# EasyEDA Pro project MicronetToNMEA.eprj

# Schematic Schematics

## Sheets
1 RF: Board Name: MicronetToNMEA; Create Date: 2024-10-03; Page Name: RF; Project Name: MicronetToNMEA; Schematic Name: MicronetToNMEA; Update Date: 2025-01-01; Company: EasyEDA.com; Drawn: EasyEDA; Page Size: A4; Part Number: JLCPCB-002; Reviewed: EasyEDA; Version: V0.1
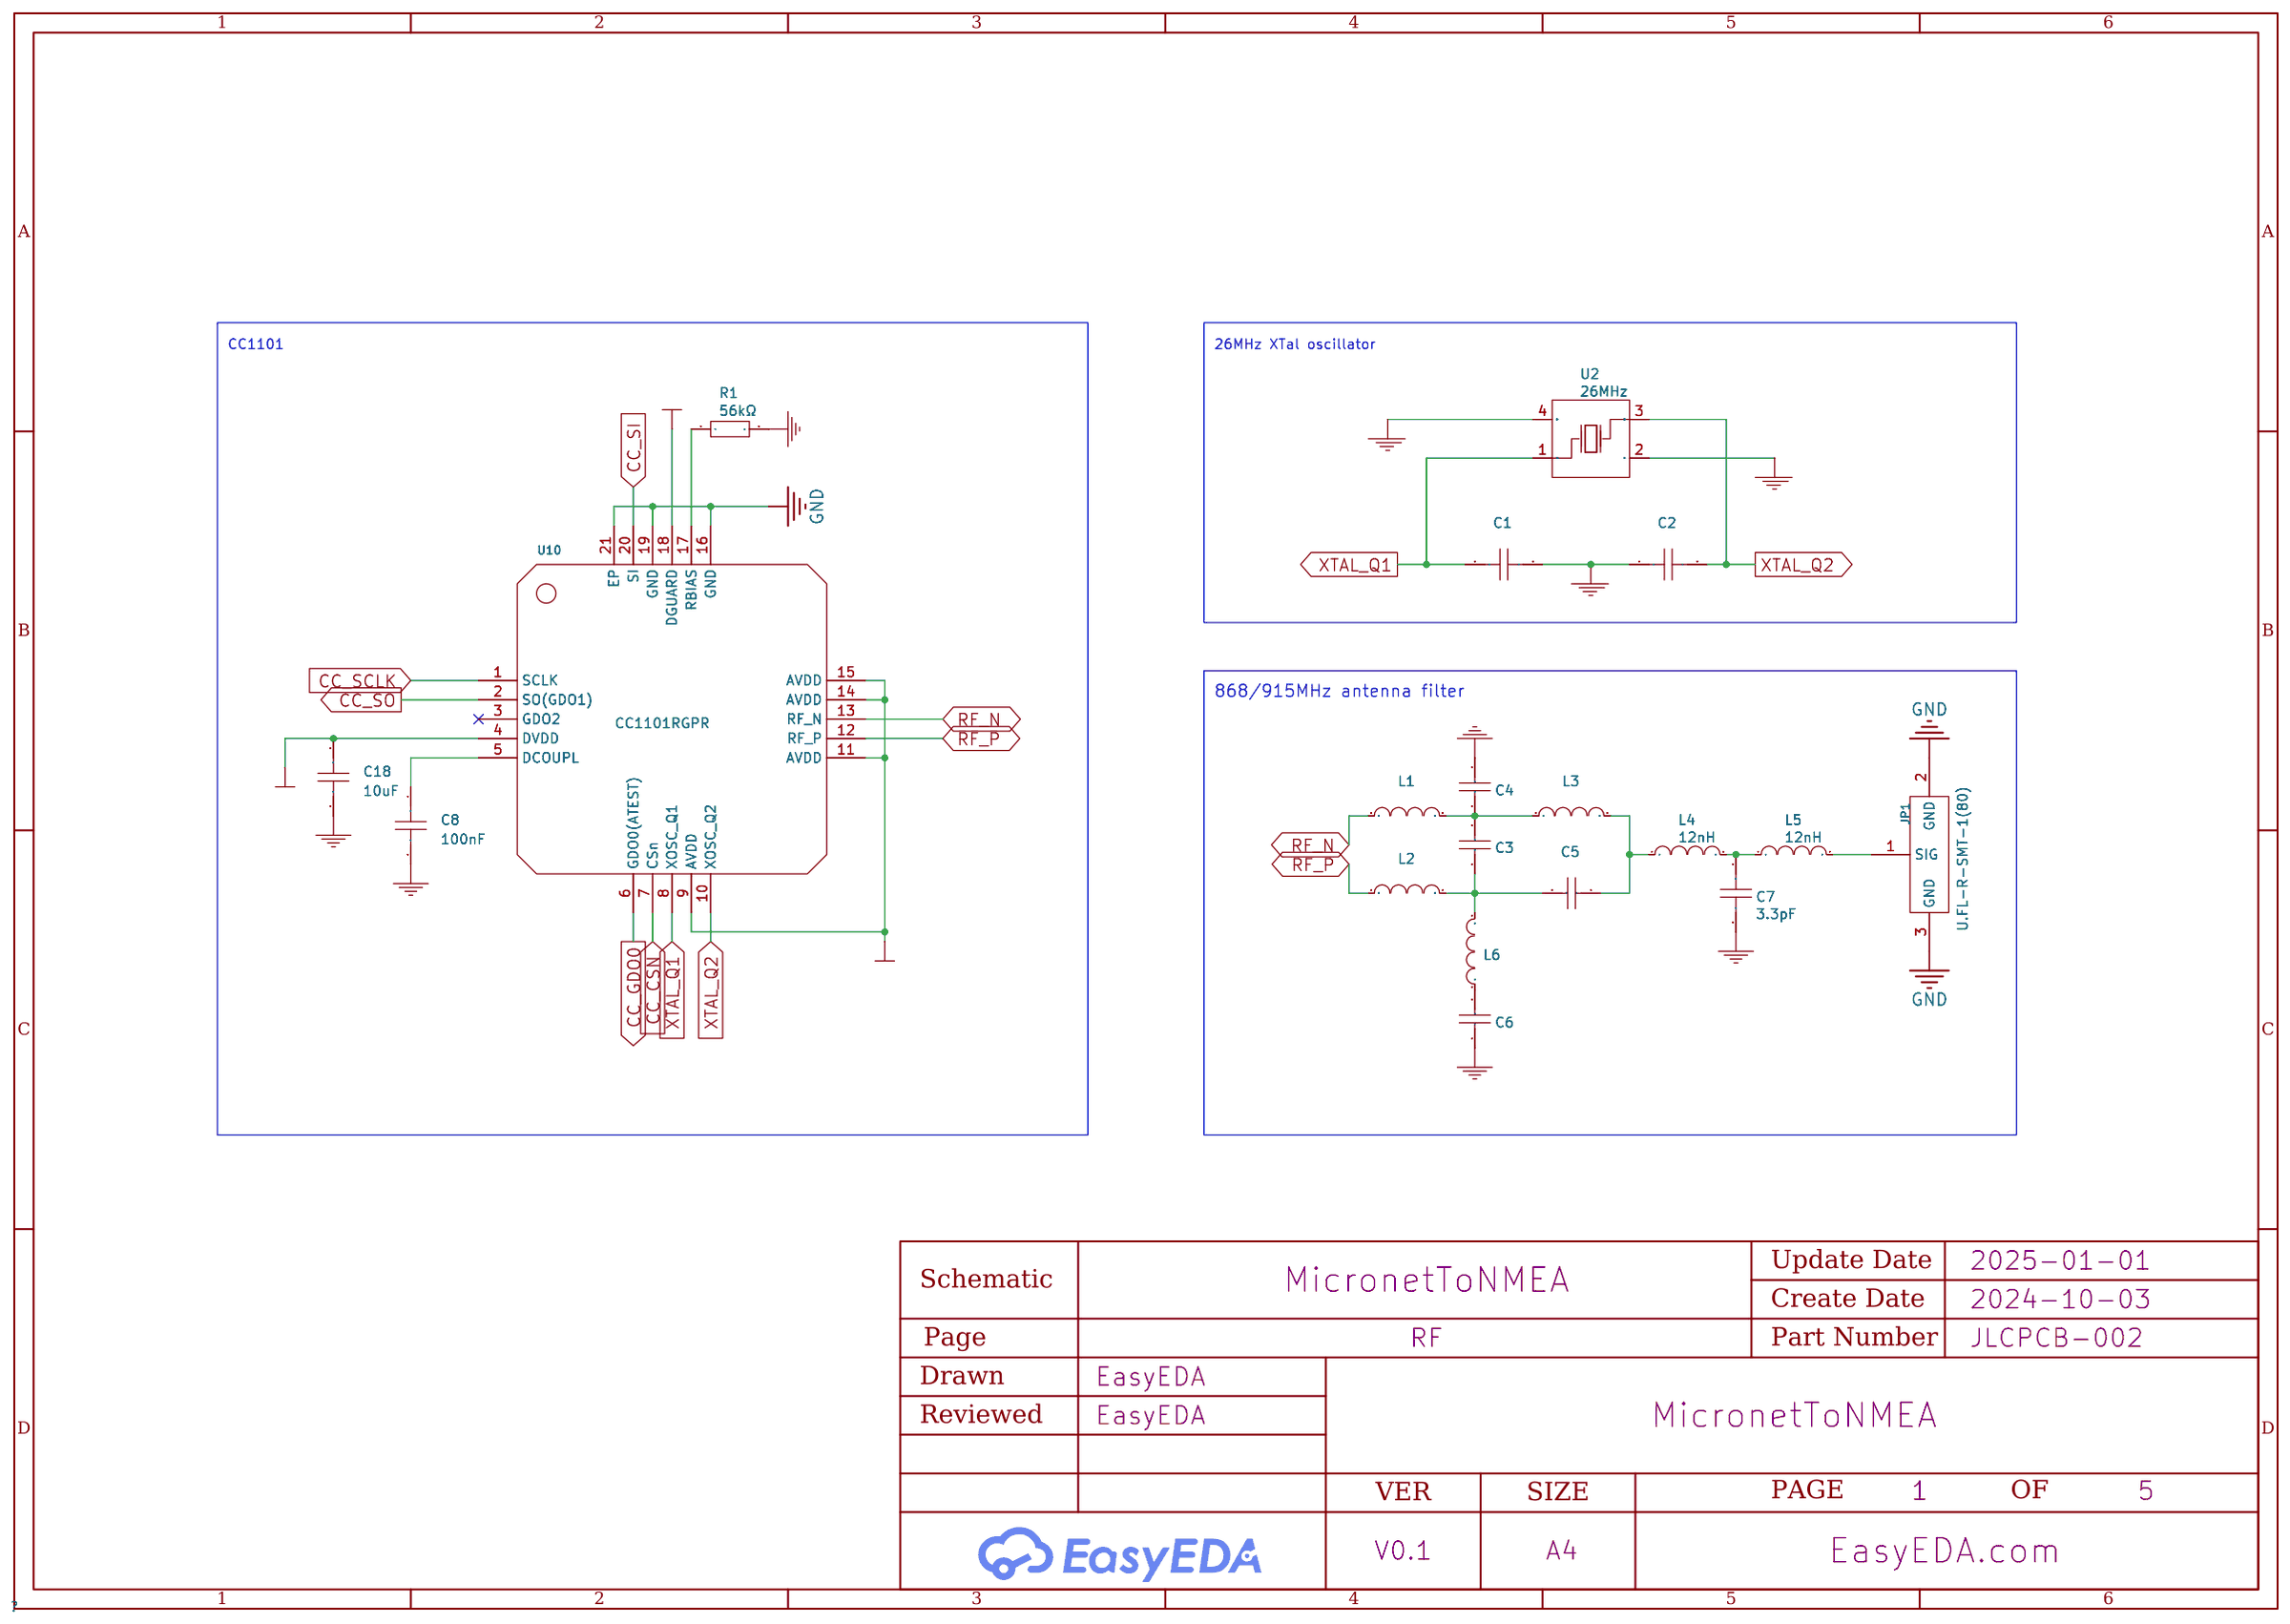
[diagram p0: RF]
2 MCU: Page Name: MCU; Schematic Name: Schematics; Update Date: 2025-01-11
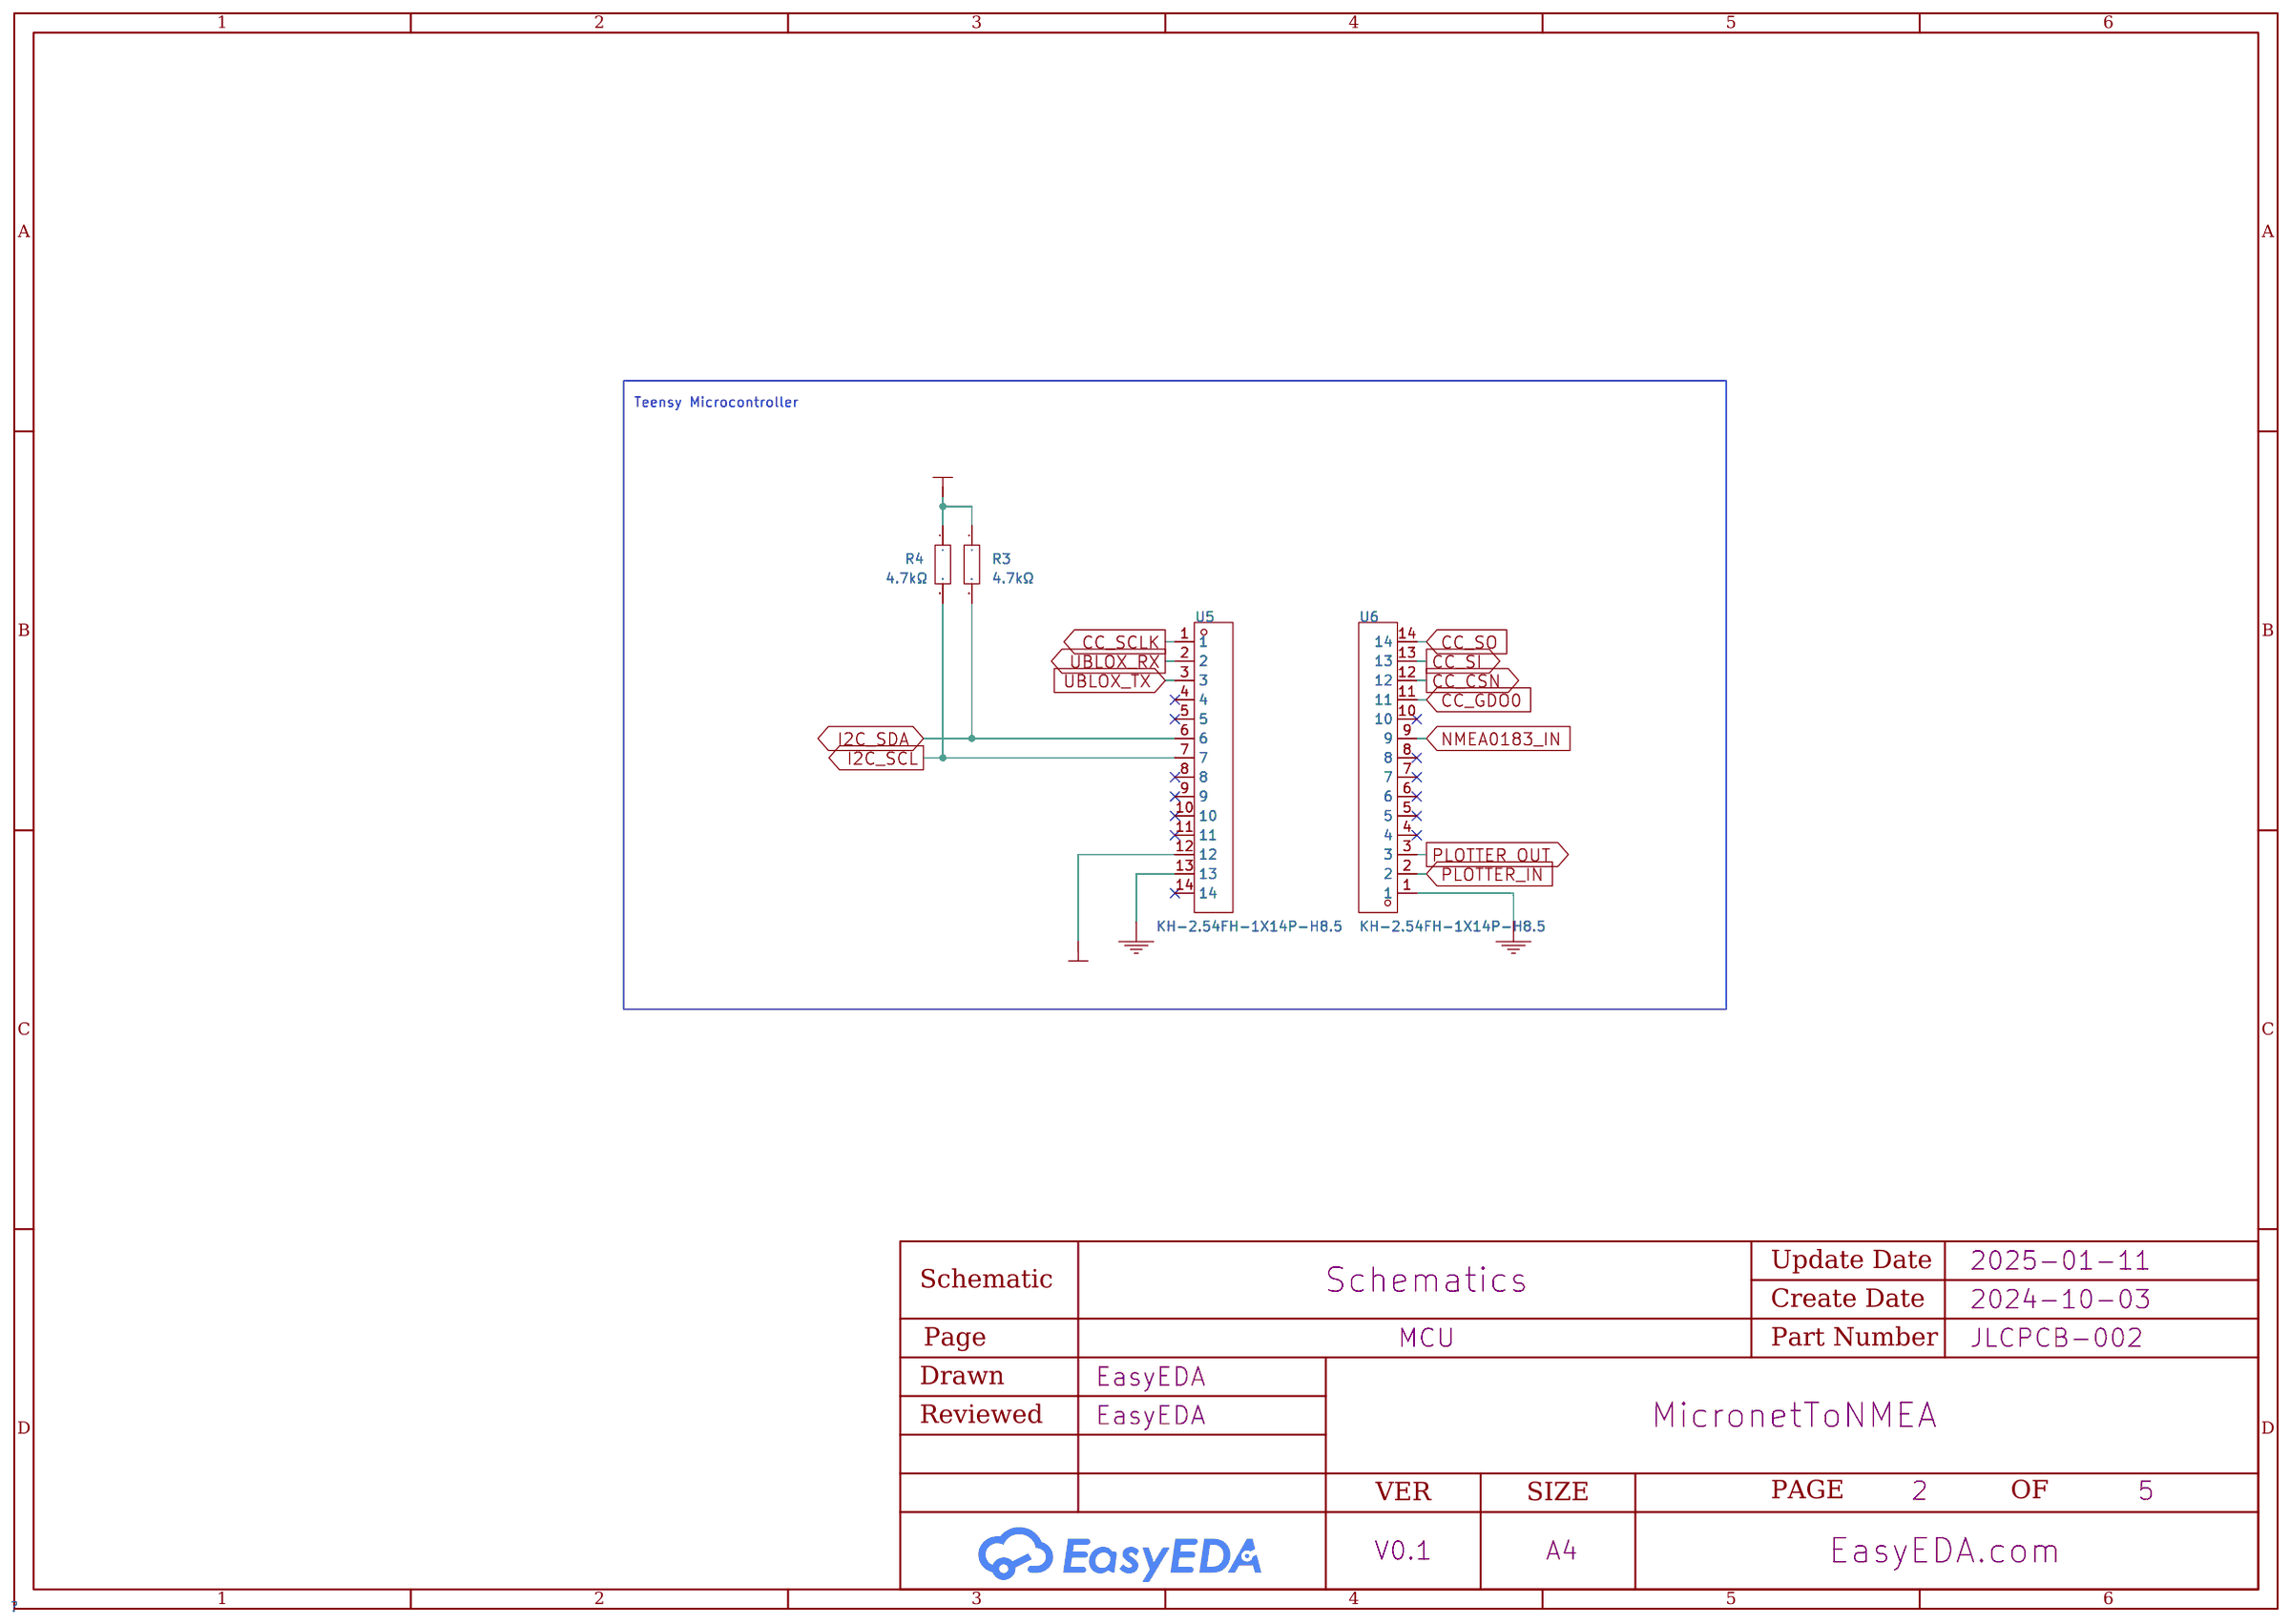
[diagram p1: MCU]
3 Peripherals: Create Date: 2024-10-08; Page Name: Peripherals; Schematic Name: Schematics; Update Date: 2025-01-06
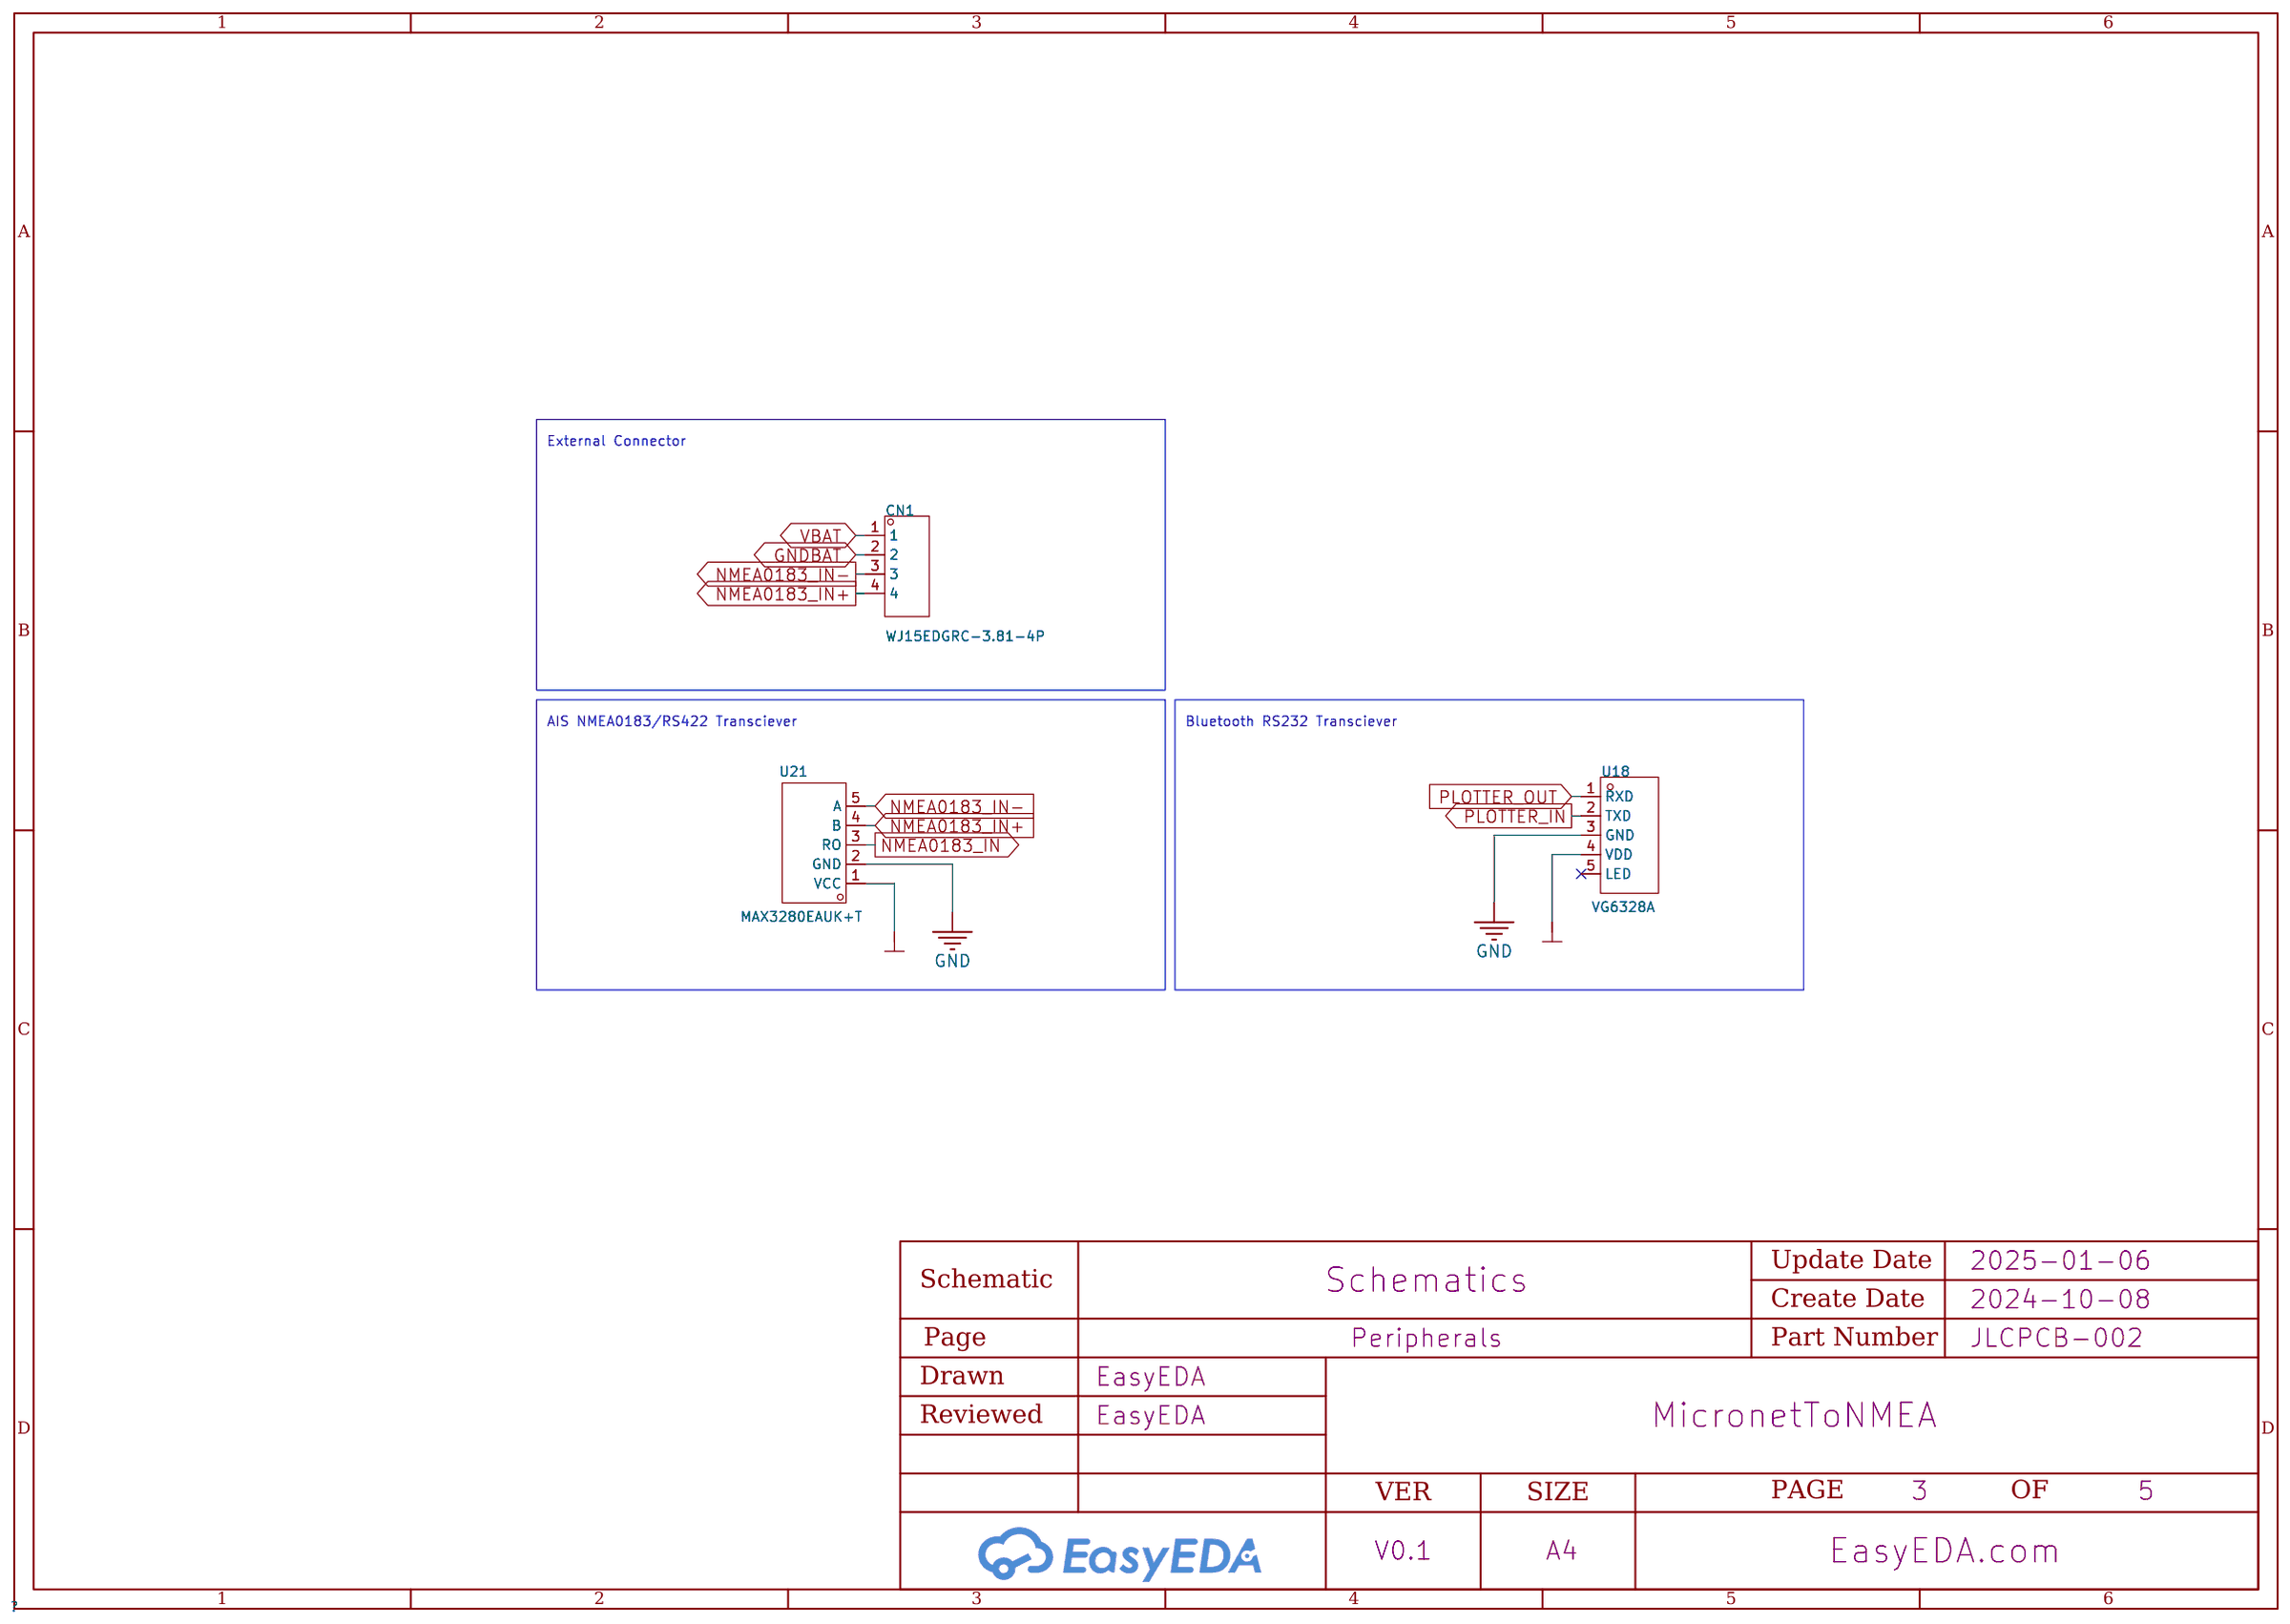
[diagram p2: Peripherals]
4 Sensors: Create Date: 2024-11-14; Page Name: Sensors; Schematic Name: Schematics; Update Date: 2025-01-29
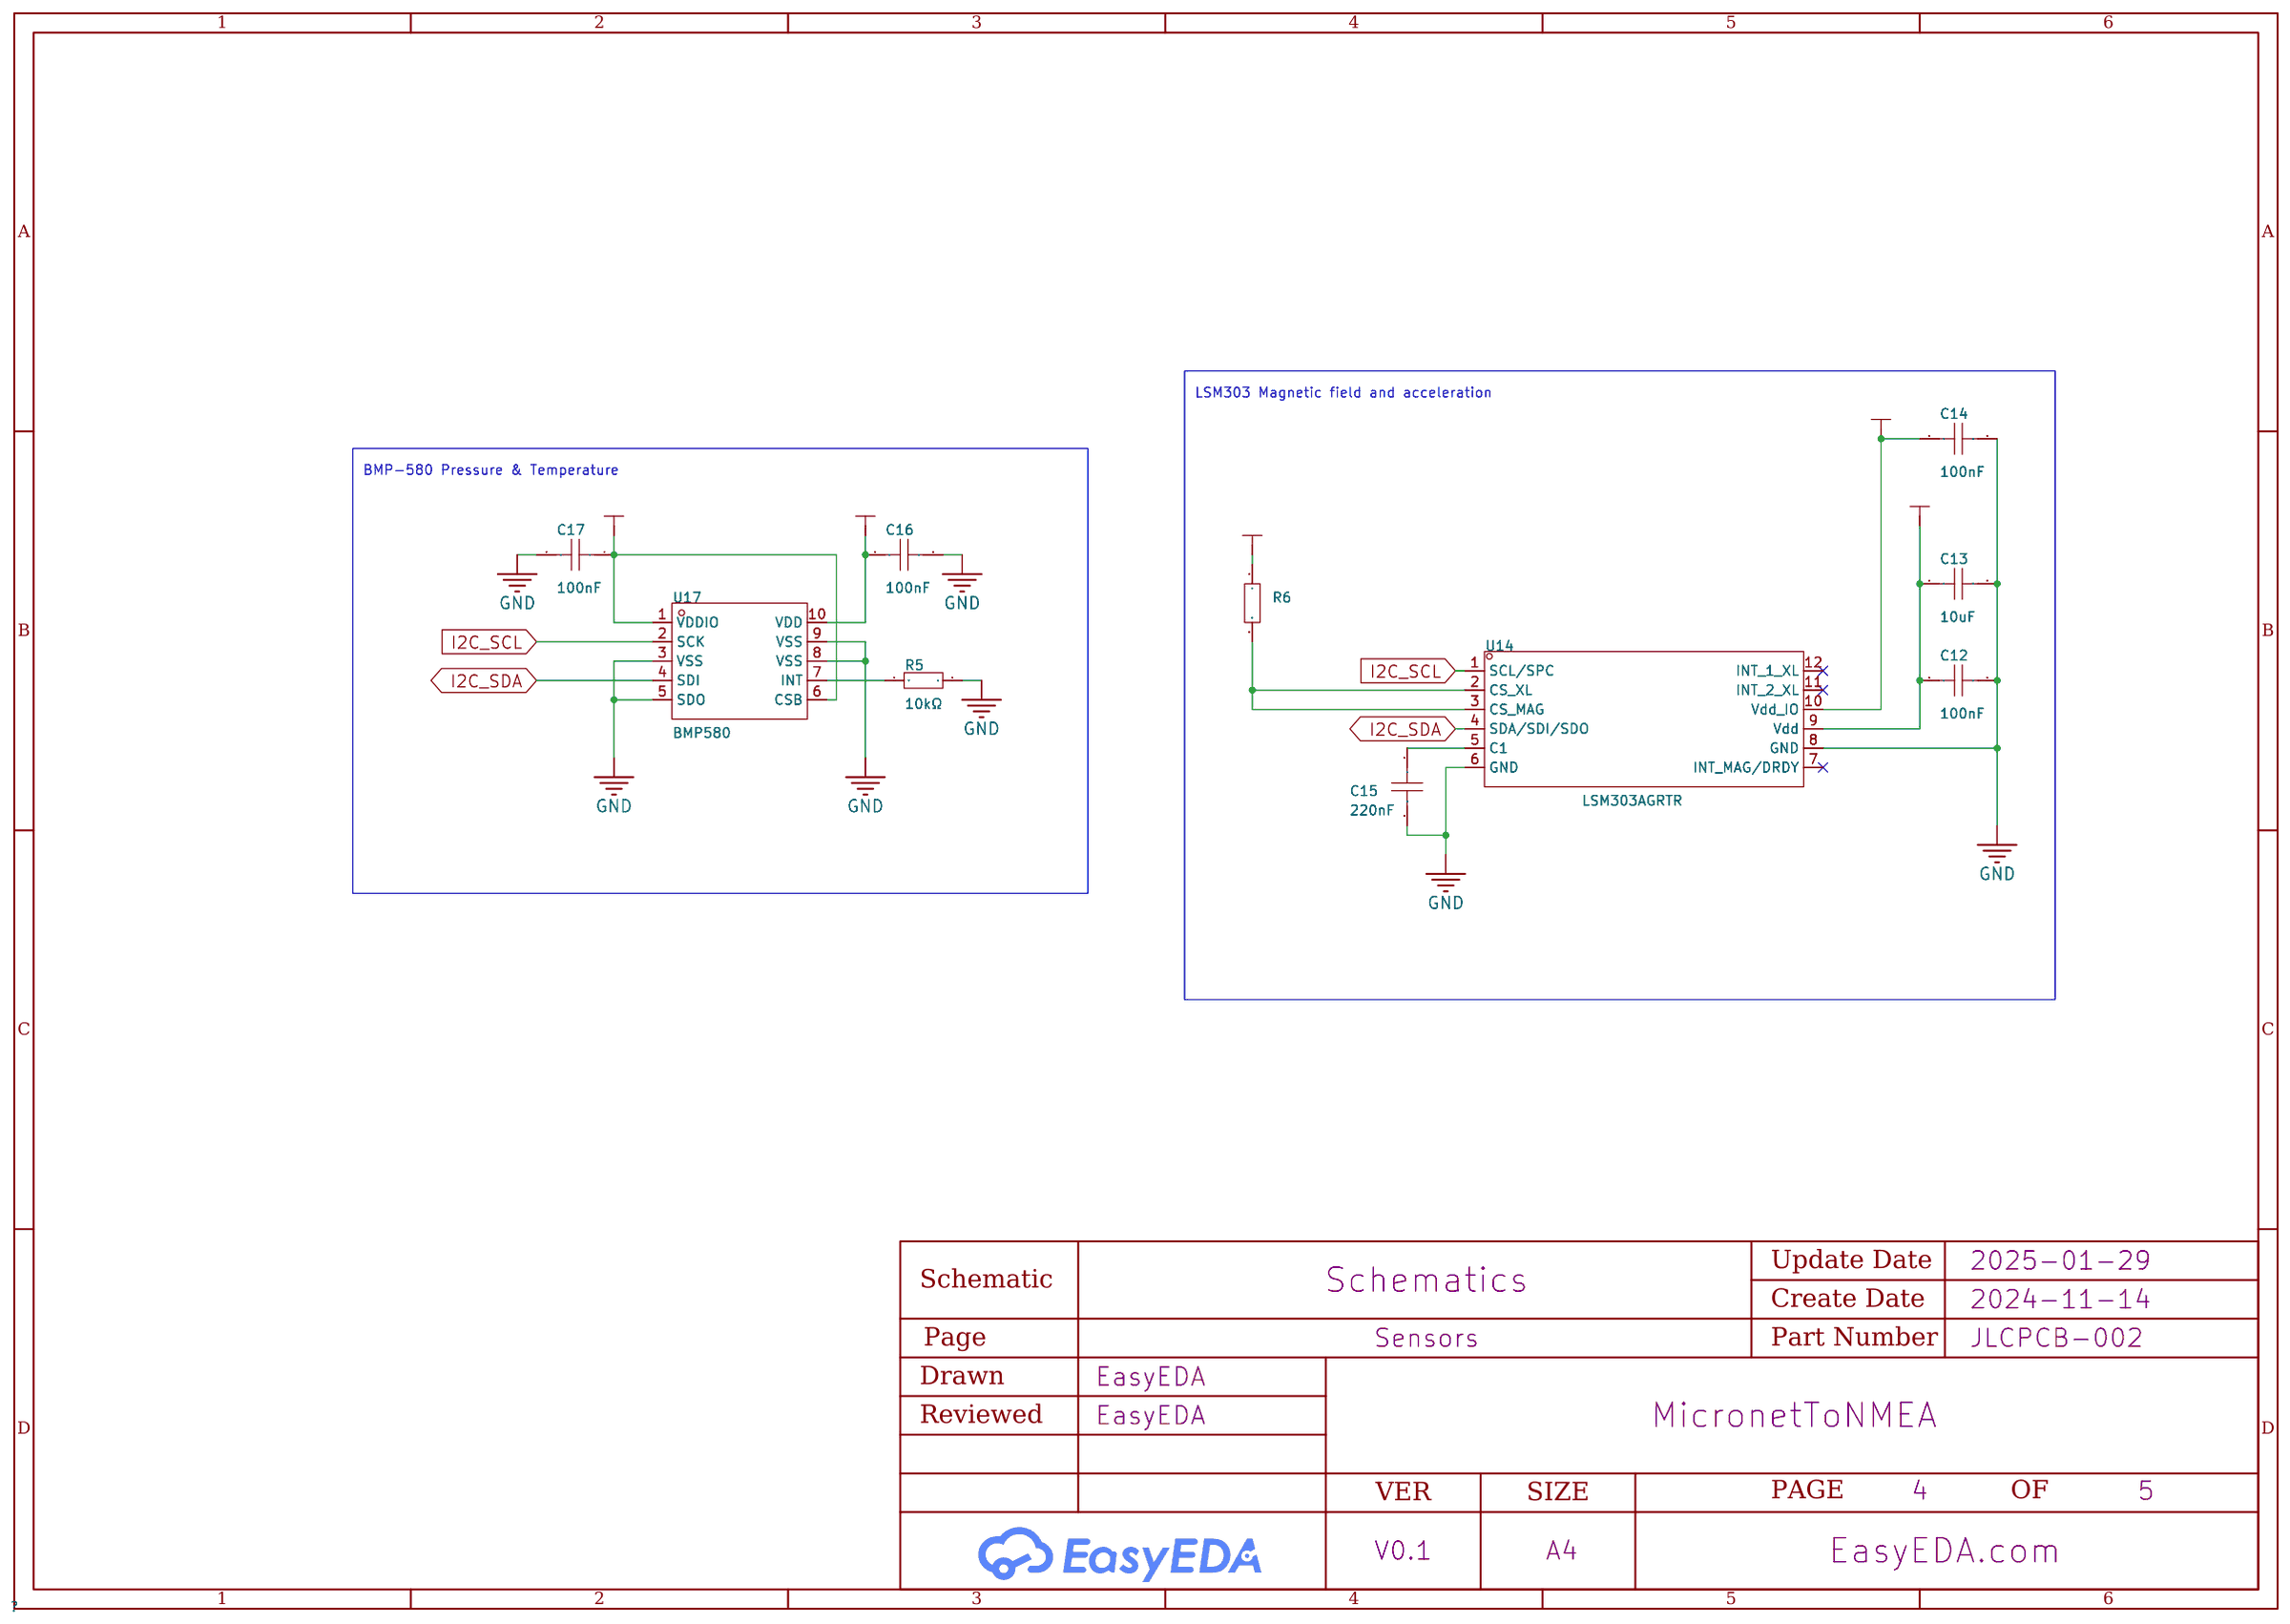
[diagram p3: Sensors]
5 Power: Create Date: 2024-11-25; Page Name: Power; Schematic Name: Schematics; Update Date: 2025-01-18
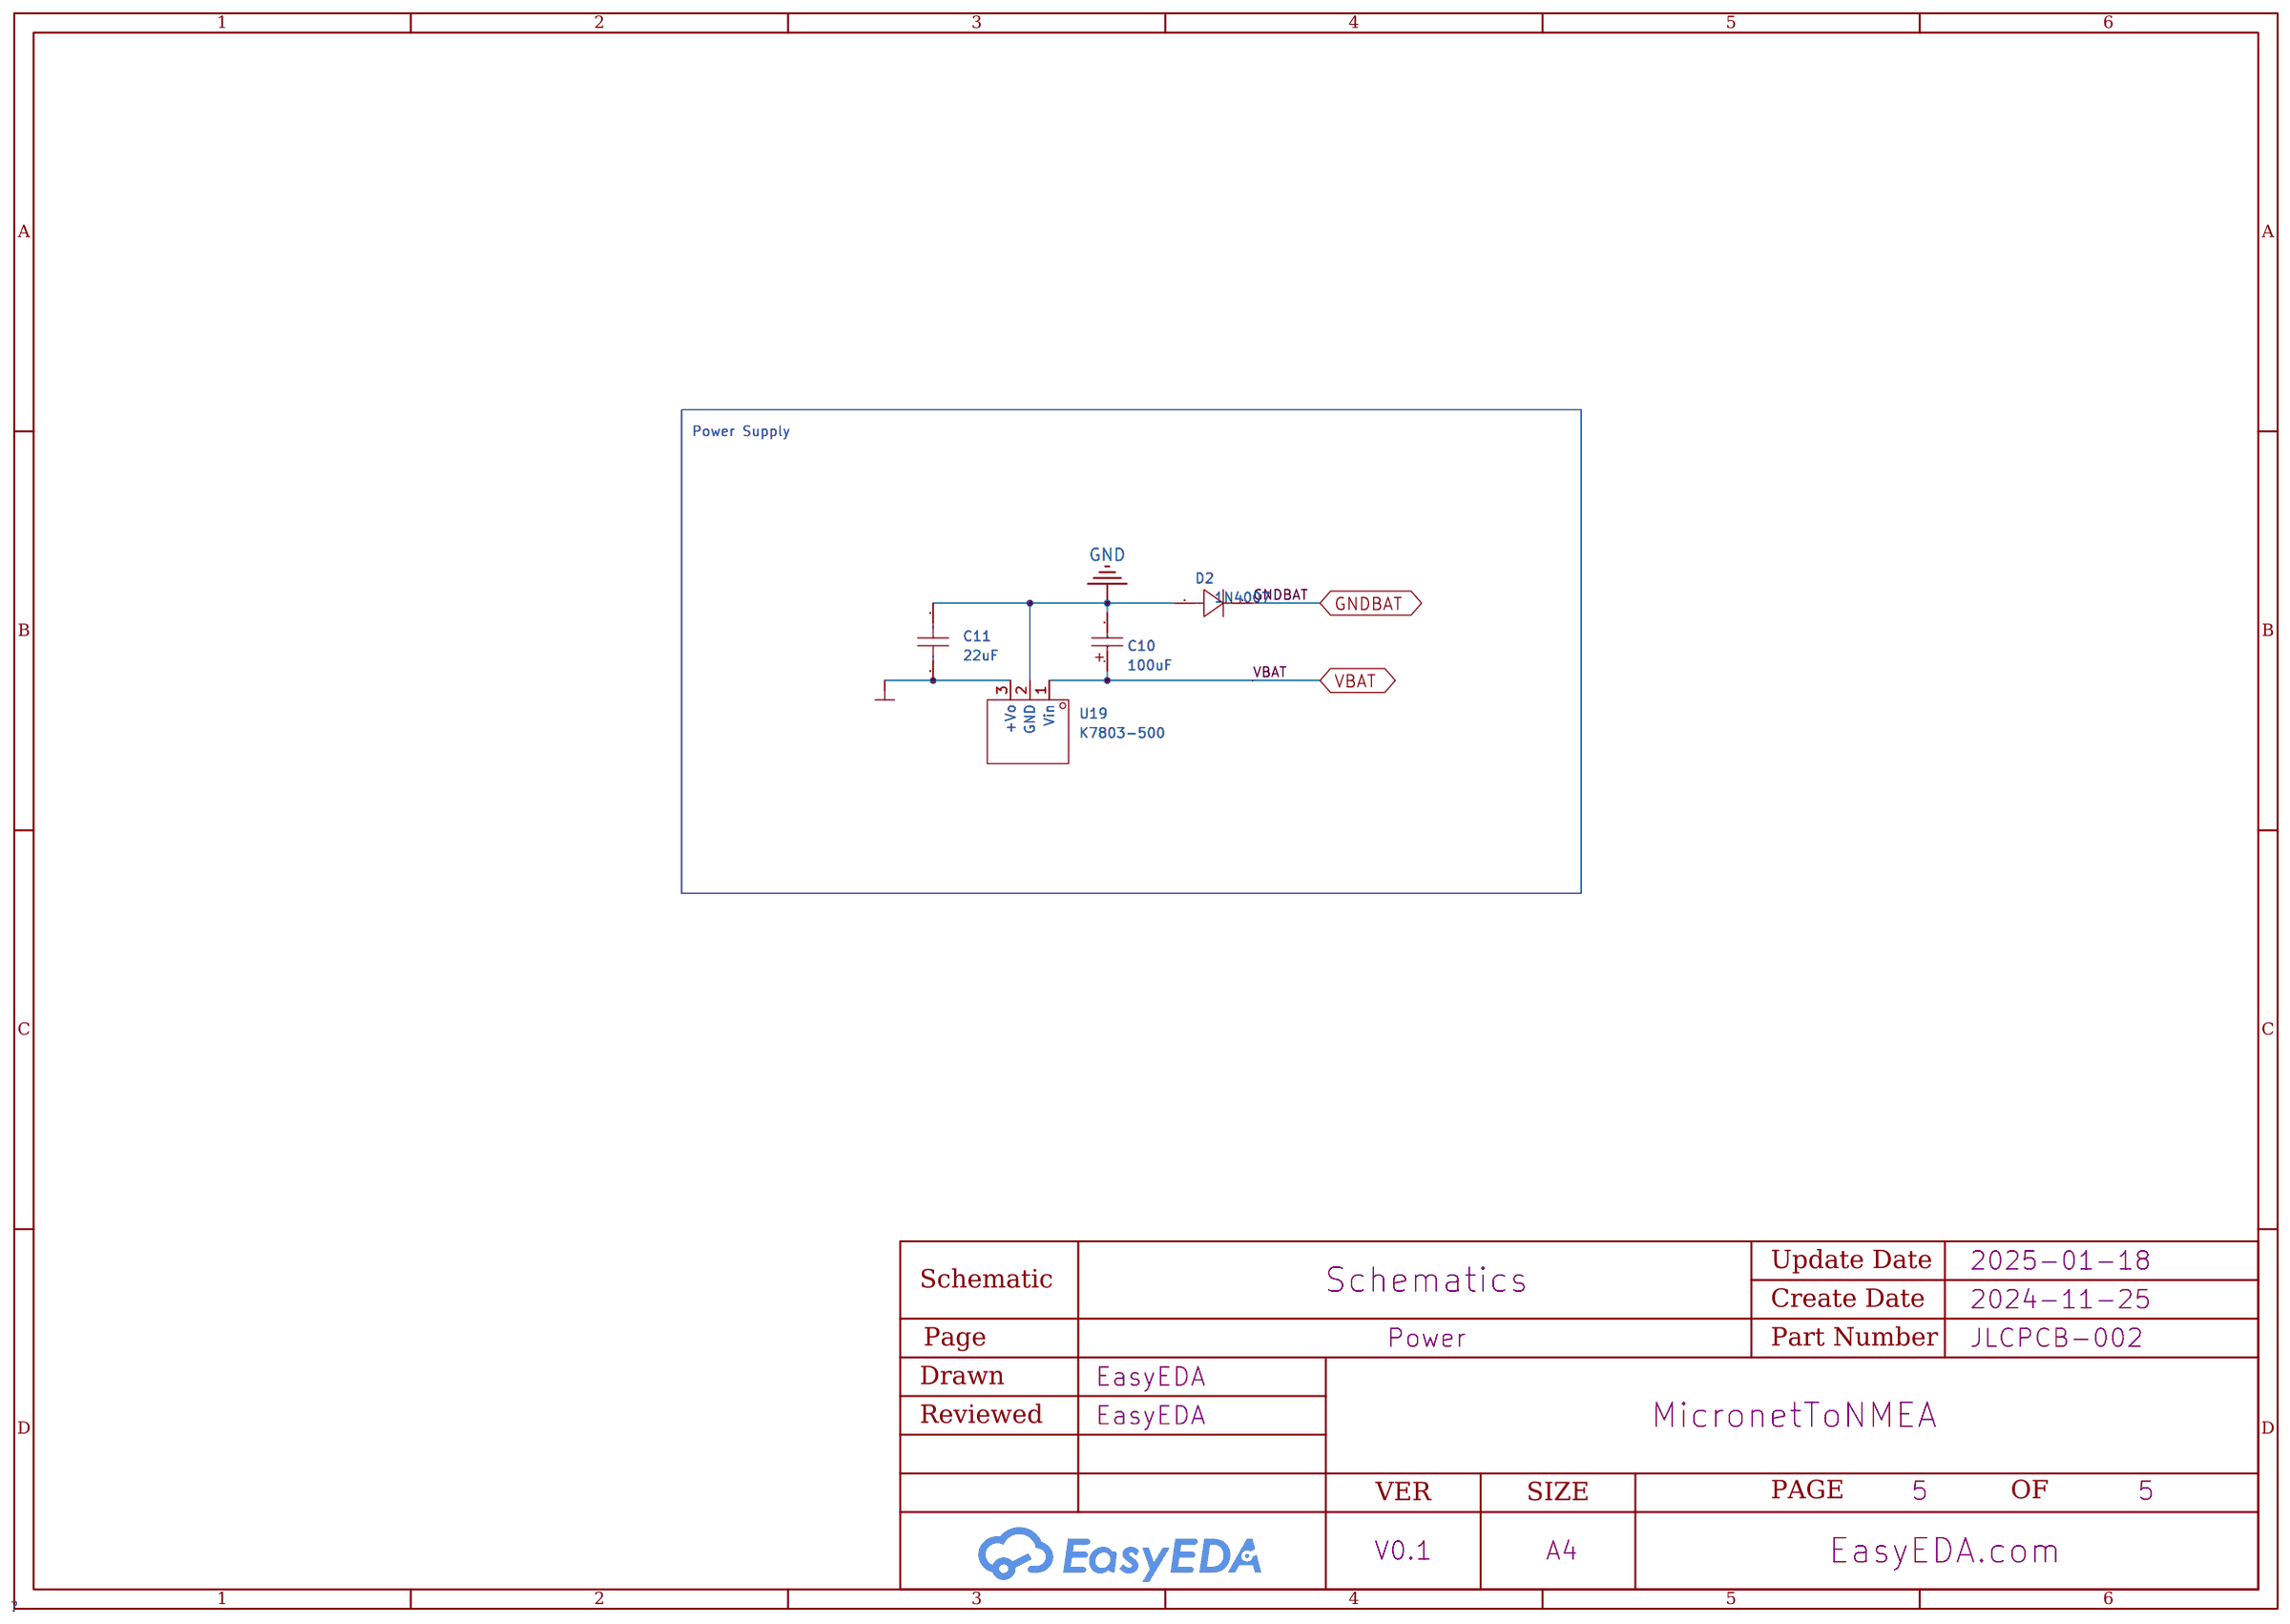
[diagram p4: Power]

## Parts
sheet MCU
R3  4.7kΩ  [R0402]
R4  4.7kΩ  [R0402]
U5  KH-2.54FH-1X14P-H8.5  [HDR-TH_14P-P2.54-V-F]
U6  KH-2.54FH-1X14P-H8.5  [HDR-TH_14P-P2.54-V-F]
sheet Peripherals
CN1  WJ15EDGRC-3.81-4P  [CONN-TH_WJ15EDGRC-3.81-4P]
U18  VG6328A  [COMM-SMD_VG6328A]
U21  MAX3280EAUK+T  [SOT-23-5_L3.0-W1.7-P0.95-LS2.8-BL]
sheet Power
C10  100uF  [CAP-SMD_BD8.0-L8.3-W8.3-FD]
C11  22uF  [C0603]
D2  1N4007  [SMA_L4.3-W2.5-LS5.0-RD]
U19  K7803-500  [PWRM-TH_K7803-500]
sheet RF
C1  27pF  [C0402]
C2  27pF  [C0402]
C3  1pF  [C0402]
C4  1.5pF  [C0402]
C5  1.5pF  [C0402]
C6  100pF  [C0402]
C7  3.3pF  [C0402]
C8  100nF  [C0402]
C18  10uF  [C0402]
JP1  U.FL-R-SMT-1(80)  [RF-SMD_FRF05002-JSS103M]
L1  12nH  [L0402]
L2  12nH  [L0402]
L3  18nH  [L0402]
L4  12nH  [L0402]
L5  12nH  [L0402]
L6  18nH  [L0402]
R1  56kΩ  [R0402]
U2  26MHz  [CRYSTAL-SMD_4P-L3.2-W2.5-BL]
U10  CC1101RGPR  [QFN-20_L4.0-W4.0-P0.5-TL-EP]
sheet Sensors
C12  100nF  [C0402]
C13  10uF  [C0402]
C14  100nF  [C0402]
C15  220nF  [C0402]
C16  100nF  [C0402]
C17  100nF  [C0402]
R5  10kΩ  [R0402]
R6  10kΩ  [R0402]
U14  LSM303AGRTR  [LGA-12_L2.0-W2.0-P0.50-BL]
U17  BMP580  [LGA-10_L2.0-W2.0-P0.50-TL_BMP580]

## Library data of the parts
R3 R4 = 0402WGF4701TCE: Type:Thick Film Resistors Resistance:4.7kΩ Tolerance:±1% Tolerance:±1% Power(Watts): Overload Voltage (Max): Temperature Coefficient:±100ppm/℃ Temperature Coefficient:±100ppm/℃ Operating Temperature Range:-55℃~+155℃ Operating Temperature Range:-55℃~+155℃; LCSC Part Name: 4.7kΩ ±1% 62.5mW 厚膜电阻; Supplier Part: C25900; Manufacturer: UNI-ROYAL(厚声); Supplier Footprint: 0402; JLCPCB Part Class: Basic Part; Datasheet: https://atta.szlcsc.com/upload/public/pdf/source/20200306/C422600_1E6D84923E4A46A82E41ADD87F860B5C.pdf; Supplier: LCSC; Type: Thick Film Resistors; Tolerance: ±1%; Temperature Coefficient: ±100ppm/℃; Operating Temperature Range: -55℃~+155℃; Check: true
U5 U6 = KH-2.54FH-1X14P-H8.5: LCSC Part Name: 间距:2.54mm 1x14P 直插; Supplier Part: C2905420; Manufacturer: kinghelm(金航标); Supplier Footprint: 插件,P=2.54mm; JLCPCB Part Class: Extended Part; Datasheet: https://atta.szlcsc.com/upload/public/pdf/source/20211019/C0FA6756E08ED2BF7CCB872A948D877C.pdf; Supplier: LCSC; Holes Structure: 1x14P; Pitch: 2.54mm; Circular Hole / Square Hole: Square Holes; Mounting Type: Straight; Number of Rows: Plugin; Number of Holes: 14P; Current Rating (Max): 3A; Holes Direction: Top; Insulation Height: 8.5mm; Operating Temperature Range: -40℃~+105℃
CN1 = WJ15EDGRC-3.81-4P: Connector Type:Receptacle-Close fixed form:- Structure:1x4P Pitch:3.81mm Color:- Mounting Style:Bend Number of Pins:4P Number of Rows:1 Number of PINs Per Row:4 Current Rating (Max):8A Voltage Rating (Max):300V Wire Gauge - AWG:- Wire Gauge - AWG:- Wire G; LCSC Part Name: 1x4P 3.81mm 排数:1 每排P数:4; Supplier Part: C7245; Manufacturer: KANGNEX(康奈克斯电气); Supplier Footprint: 弯插,P=3.81mm; JLCPCB Part Class: Extended Part; Datasheet: https://atta.szlcsc.com/upload/public/pdf/source/20191225/C7245_837ECEBE031BAC19A7EBD4F3127022E5.pdf; Supplier: LCSC; Connector Type: Receptacle-Close; Structure: 1x4P; Pitch: 3.81mm; Mounting Style: Bend; Number of Pins: 4P; Number of Rows: 1; Number of PINs Per Row: 4; Current Rating (Max): 8A; Voltage Rating (Max): 300V; Contact Material: Brass; Contact Plating: Tin; Operating Temperature Range: -40℃~+105℃
U18 = VG6328A: LCSC Part Name: 6328A低成本串口蓝牙模块; Supplier Part: C20539408; Manufacturer: Vollgo(沃进); Supplier Footprint: SMD,16x13.6mm; JLCPCB Part Class: Extended Part; Datasheet: https://atta.szlcsc.com/upload/public/pdf/source/20240112/5EEE1D6A89302B67E38E5FC88F83A793.pdf; Supplier: LCSC; Check: true
U21 = MAX3280EAUK+T: Types:Receivers Number of Driver:0 Number of receiver:1 Supply Voltage:3V~5.5V Supply Voltage:3V~5.5V Data Rate:52Mbps Data Rate:52Mbps Operating Temperature:-40℃~+125℃ Operating Temperature:-40℃~+125℃; LCSC Part Name: ±15kV ESD保护，52Mbps，3V至5.5V，SOT23封装RS-485/RS-422真故障安全接收器; Supplier Part: C131126; Manufacturer: ADI(亚德诺)/MAXIM(美信); Supplier Footprint: SOT-23-5; JLCPCB Part Class: Extended Part; Datasheet: https://atta.szlcsc.com/upload/public/pdf/source/20170919/C131126_1505787254709976995.pdf; Supplier: LCSC; Types: Receivers; Number of Driver: 0; Number of receiver: 1; Supply Voltage: 3V~5.5V; Data Rate: 52Mbps; Operating Temperature: -40℃~+125℃; Check: true
C10 = EEEFK1H101P_C178548: Capacitance: Tolerance:±20% Tolerance:±20% Rated Voltage: Ripple Current:262.5mA@120Hz Equivalent Series Resistance(ESR):- φD: L: Lifetime @ Temp:5000hrs@105℃ Operating Temperature:-55℃~+105℃ Operating Temperature:-55℃~+105℃; LCSC Part Name: 100uF ±20% 50V; Supplier Part: C178548; Manufacturer: PANASONIC(松下); Manufacturer Part: EEEFK1H101P; Supplier Footprint: SMD,D8xL10.2mm; JLCPCB Part Class: Extended Part; Datasheet: https://atta.szlcsc.com/upload/public/pdf/source/20180327/C178734_B73BC829014A39870A1CD50DCE59BFEE.pdf; Supplier: LCSC; Tolerance: ±20%; Ripple Current: 262.5mA@120Hz; Lifetime @ Temp: 5000hrs@105℃; Operating Temperature: -55℃~+105℃
C11 = CL10A226MO7JZNC: Capacitance: Tolerance:±20% Tolerance:±20% Voltage Rated: Temperature Coefficient:; LCSC Part Name: 22uF ±20% 16V; Supplier Part: C2762594; Manufacturer: SAMSUNG(三星); Supplier Footprint: 0603; JLCPCB Part Class: Extended Part; Datasheet: https://atta.szlcsc.com/upload/public/pdf/source/20220811/0832C3B1C642040B023B7A6186895861.pdf; Supplier: LCSC; Tolerance: ±20%
D2 = 1N4007_C727081: Diode Configuration:Independent Type Forward Voltage (Vf@If):1.1V@1A Reverse Voltage (Vr): Rectified Current: Reverse Leakage Current (Ir):5uA; Supplier Part: C727081; Manufacturer: TWGMC(台湾迪嘉); Supplier Footprint: SMA(DO-214AC); JLCPCB Part Class: Extended Part; Datasheet: https://atta.szlcsc.com/upload/public/pdf/source/20200828/C727079_3A05254382567072883400655AE0ED46.pdf; Supplier: LCSC; Diode Configuration: Independent Type; Forward Voltage (Vf@If): 1.1V@1A; Reverse Leakage Current (Ir): 5uA
U19 = K7803-500_C19191249: Supplier Part: C19191249; Manufacturer: DEXU(德旭电子); Supplier Footprint: SIP-3; JLCPCB Part Class: Extended Part; Datasheet: https://atta.szlcsc.com/upload/public/pdf/source/20231110/2DF27CB59CC75D0EC81D3527E3B2B1C5.pdf; Supplier: LCSC
C1 C2 = GJM1555C1H270FB01D: Capacitance: Tolerance:±1% Tolerance:±1% Voltage Rated: Temperature Coefficient:; LCSC Part Name: 27pF ±1% 50V; Supplier Part: C88883; Manufacturer: muRata(村田); Supplier Footprint: 0402; JLCPCB Part Class: Extended Part; Datasheet: https://atta.szlcsc.com/upload/public/pdf/source/20190904/C426118_85E81C7C1F21FC87C5FB6D536E0847B4.pdf; Supplier: LCSC; Tolerance: ±1%; Check: true
C3 = GRM1555C1H1R0CA01D: Capacitance: Voltage Rated: Temperature Coefficient:; LCSC Part Name: 1pF 50V; Supplier Part: C76953; Manufacturer: muRata(村田); Supplier Footprint: 0402; JLCPCB Part Class: Extended Part; Datasheet: https://atta.szlcsc.com/upload/public/pdf/source/20180307/C76953_15204091218821407741.pdf; Supplier: LCSC; Check: true
C4 C5 = GRM1555C1H1R5BA01D: Capacitance: Voltage Rated: Temperature Coefficient:; LCSC Part Name: 1.5pF 50V; Supplier Part: C76957; Manufacturer: muRata(村田); Supplier Footprint: 0402; JLCPCB Part Class: Extended Part; Datasheet: https://atta.szlcsc.com/upload/public/pdf/source/20180307/C76957_15204091256371407745.pdf; Supplier: LCSC; Check: true
C6 = GRM1555C1H101JA01D: Capacitance: Tolerance:±5% Tolerance:±5% Voltage Rated: Temperature Coefficient:; LCSC Part Name: 100pF ±5% 50V; Supplier Part: C77177; Manufacturer: muRata(村田); Supplier Footprint: 0402; JLCPCB Part Class: Extended Part; Datasheet: https://atta.szlcsc.com/upload/public/pdf/source/20161108/1478586482814.pdf; Supplier: LCSC; Tolerance: ±5%; Check: true
C7 = GRM1555C1H3R3CA01D: Capacitance: Voltage Rated: Temperature Coefficient:; LCSC Part Name: 3.3pF 50V; Supplier Part: C76968; Manufacturer: muRata(村田); Supplier Footprint: 0402; JLCPCB Part Class: Extended Part; Datasheet: https://atta.szlcsc.com/upload/public/pdf/source/20180326/C76968_42A943F46D0EB2822F2395CFA6966D50.pdf; Supplier: LCSC; Check: true
C8 = GRM155R62A104KE14D: Capacitance: Tolerance:±10% Tolerance:±10% Voltage Rated: Temperature Coefficient:; LCSC Part Name: 100nF ±10% 100V; Supplier Part: C162178; Manufacturer: muRata(村田); Supplier Footprint: 0402; JLCPCB Part Class: Extended Part; Datasheet: https://atta.szlcsc.com/upload/public/pdf/source/20200921/C162178_EF61A2DC43497DE67E2F462D3389BE9B.pdf; Supplier: LCSC; Tolerance: ±10%; Check: true
C18 = GRM155R61A106ME44D: Capacitance: Tolerance:±20% Tolerance:±20% Voltage Rated: Temperature Coefficient:; LCSC Part Name: 10uF ±20% 10V; Supplier Part: C77000; Manufacturer: muRata(村田); Supplier Footprint: 0402; JLCPCB Part Class: Extended Part; Datasheet: https://atta.szlcsc.com/upload/public/pdf/source/20180530/C77000_4866797CFE3A842CD03C597EBD6AE6CD.pdf; Supplier: LCSC; Tolerance: ±20%
JP1 = U.FL-R-SMT-1(80)_C88374: LCSC Part Name: IPEX 内针; Supplier Part: C88374; Manufacturer: HRS(广濑); Supplier Footprint: SMD; JLCPCB Part Class: Extended Part; Datasheet: https://atta.szlcsc.com/upload/public/pdf/source/20161125/1480067868647.pdf; Supplier: LCSC; Connector Type: 板端; Interface Type: 内针; Number of Ports: 1; Interface Diameter: 2mm; Interface Length/Height: 1.25mm; Frequency-Max: 6GHz; RF Series: IPEX; Impedance: 50Ω; Contact Material: Brass; Operating Temperature Range: -40℃~+90℃; Check: true
L1 L2 = LQW15AN12NJ00D: Inductance: Tolerance:±5% Tolerance:±5% Rated Current: Saturation Current (Isat):- DC Resistance (DCR): Ratings:-; LCSC Part Name: 12nH ±5%; Supplier Part: C82920; Manufacturer: muRata(村田); Supplier Footprint: 0402; JLCPCB Part Class: Extended Part; Datasheet: https://atta.szlcsc.com/upload/public/pdf/source/20170505/1493951387766.pdf; Supplier: LCSC; Tolerance: ±5%; Check: true
L3 L6 = LQW15AN18NJ00D: Inductance: Tolerance:±5% Tolerance:±5% Rated Current: Saturation Current (Isat):- DC Resistance (DCR): Ratings:-; LCSC Part Name: 18nH ±5%; Supplier Part: C82917; Manufacturer: muRata(村田); Supplier Footprint: 0402; JLCPCB Part Class: Extended Part; Datasheet: https://atta.szlcsc.com/upload/public/pdf/source/20170325/1490427880337.pdf; Supplier: LCSC; Tolerance: ±5%; Check: true
L4 L5 = LQW15AN12NG00D: Inductance: Tolerance:±2% Tolerance:±2% Rated Current: Saturation Current (Isat):- DC Resistance (DCR): Ratings:-; LCSC Part Name: 12nH ±2%; Supplier Part: C86128; Manufacturer: muRata(村田); Supplier Footprint: 0402; JLCPCB Part Class: Extended Part; Datasheet: https://atta.szlcsc.com/upload/public/pdf/source/20161104/1478253457680.pdf; Supplier: LCSC; Tolerance: ±2%; Check: true
R1 = RK73H1ETTP5602F: Type:Thick Film Resistors Resistance: Tolerance:±1% Tolerance:±1% Power(Watts): Overload Voltage (Max): Temperature Coefficient:±100ppm/℃ Temperature Coefficient:±100ppm/℃ Operating Temperature Range:-55℃~+155℃ Operating Temperature Range:-55℃~+155℃; LCSC Part Name: 厚膜电阻 56kΩ ±1% 100mW; Supplier Part: C71703; Manufacturer: KOA; Supplier Footprint: 0402; JLCPCB Part Class: Extended Part; Datasheet: https://atta.szlcsc.com/upload/public/pdf/source/20180126/C171778_15169517982501308609.pdf; Supplier: LCSC; Type: Thick Film Resistors; Tolerance: ±1%; Temperature Coefficient: ±100ppm/℃; Operating Temperature Range: -55℃~+155℃; Check: true
U2 = S3226000151040: Crystal Type:贴片晶振 Frequency: Normal temperature Frequency Tolerance:±10ppm Normal temperature Frequency Tolerance:±10ppm External load capacitor: Equivalent Series Resistance (ESR):40Ω Operating Temperature: Operating Temperature:; LCSC Part Name: 26MHz ±10ppm 15pF; Supplier Part: C479205; Manufacturer: JGHC(晶光华); Supplier Footprint: SMD3225-4P; JLCPCB Part Class: Extended Part; Datasheet: https://atta.szlcsc.com/upload/public/pdf/source/20230522/40D5BBD3CE23FDD9A2980F79514F1325.pdf; Supplier: LCSC; Crystal Type: 贴片晶振; Normal temperature Frequency Tolerance: ±10ppm; Equivalent Series Resistance (ESR): 40Ω; Check: true
U10 = CC1101RGPR: LCSC Part Name: 低功率射频收发器 专为极低功耗无线应用设计; Supplier Part: C29953; Manufacturer: TI(德州仪器); Supplier Footprint: QFN-20-EP(4x4); JLCPCB Part Class: Extended Part; Datasheet: https://www.ti.com/cn/lit/gpn/cc1101; Supplier: LCSC; Frequency Range: 779MHz~928MHz；300MHz~348MHz; Interface: SPI; Operating Voltage: 1.8V~3.6V; Applications: General-purposeISM; Output Power: 12dBm; Data Rate: 600Kbps; Current Of Transmitting: 12.3mA; Sensitivity: -116dBm; Receive Current: 14.3mA; Typical Application Frequency: 433MHz；315MHz; Operating Temperature: -40℃~+85℃; Check: true
C12 C14 C16 C17 = CL05B104KO5NNNC: Capacitance: Tolerance:±10% Tolerance:±10% Voltage Rated: Temperature Coefficient:; LCSC Part Name: 100nF ±10% 16V; Supplier Part: C1525; Manufacturer: SAMSUNG(三星); Supplier Footprint: 0402; JLCPCB Part Class: Basic Part; Datasheet: https://atta.szlcsc.com/upload/public/pdf/source/20160218/1457707763339.pdf; Supplier: LCSC; Tolerance: ±10%
C13 = GRM155R60J106ME44D: Capacitance: Tolerance:±20% Tolerance:±20% Voltage Rated: Temperature Coefficient:; LCSC Part Name: 10uF ±20% 6.3V; Supplier Part: C76991; Manufacturer: muRata(村田); Supplier Footprint: 0402; JLCPCB Part Class: Extended Part; Datasheet: https://atta.szlcsc.com/upload/public/pdf/source/20200305/C490387_23319AE8C154DEB24C505E6C82A8106A.pdf; Supplier: LCSC; Tolerance: ±20%; Check: true
C15 = CL05B224KO5NNNC: Capacitance: Tolerance:±10% Tolerance:±10% Voltage Rated: Temperature Coefficient:; LCSC Part Name: 220nF ±10% 16V; Supplier Part: C16772; Manufacturer: SAMSUNG(三星); Supplier Footprint: 0402; JLCPCB Part Class: Basic Part; Datasheet: https://atta.szlcsc.com/upload/public/pdf/source/20160218/1457707763339.pdf; Supplier: LCSC; Tolerance: ±10%
R5 R6 = 0402WGJ0103TCE: Type:Thick Film Resistors Resistance:10kΩ Tolerance:±5% Tolerance:±5% Power(Watts): Overload Voltage (Max): Temperature Coefficient:±100ppm/℃ Temperature Coefficient:±100ppm/℃ Operating Temperature Range:-55℃~+155℃ Operating Temperature Range:-55℃~+155℃; LCSC Part Name: 10kΩ ±5% 62.5mW 厚膜电阻; Supplier Part: C25531; Manufacturer: UNI-ROYAL(厚声); Supplier Footprint: 0402; JLCPCB Part Class: Extended Part; Datasheet: https://atta.szlcsc.com/upload/public/pdf/source/20200306/C422600_1E6D84923E4A46A82E41ADD87F860B5C.pdf; Supplier: LCSC; Type: Thick Film Resistors; Tolerance: ±5%; Temperature Coefficient: ±100ppm/℃; Operating Temperature Range: -55℃~+155℃
U14 = LSM303AGRTR: Supplier Part: C126671; Manufacturer: ST(意法半导体); Supplier Footprint: LGA-12(2x2); JLCPCB Part Class: Extended Part; Datasheet: https://atta.szlcsc.com/upload/public/pdf/source/20180403/C126671_E4CABC5ABBEC58D74E548CEDEFA0489C.pdf; Supplier: LCSC; Sensor Type: 加速度传感器; Operating Temperature: -40℃~+85℃; Check: true
U17 = BMP580: Supplier Part: C22391138; Manufacturer: Bosch(博世); Supplier Footprint: LGA-10(2x2); JLCPCB Part Class: Extended Part; Datasheet: https://atta.szlcsc.com/upload/public/pdf/source/20240724/E2D6053E980096703E6C36C0338E6FAD.pdf; Supplier: LCSC; Check: true

## Nets
+3.3V: C11.2 C12.1 C13.1 C14.2 C16.1 C17.1 C18.2 R3.1 R4.1 R6.1 U5.12 U10.4(DVDD) U10.9(AVDD) U10.11(AVDD) U10.14(AVDD) U10.15(AVDD) U10.18(DGUARD) U14.9(Vdd) U14.10(Vdd_IO) U17.1(VDDIO) U17.6(CSB) U17.10(VDD) U18.4(VDD) U19.3(+Vo) U21.1(VCC)
GND: C1.2 C2.1 C4.2 C6.2 C7.2 C8.2 C10.2 C11.1 C12.2 C13.2 C14.1 C15.2 C16.2 C17.2 C18.1 D2.2(A) JP1.2(GND) JP1.3(GND) R1.2 R5.1 U2.2(GND) U2.4(GND) U5.13 U6.1 U10.16(GND) U10.19(GND) U10.21(EP) U14.6(GND) U14.8(GND) U17.3(VSS) U17.5(SDO) U17.8(VSS) U17.9(VSS) U18.3(GND) U19.2(GND) U21.2(GND)
GNDBAT: CN1.2 D2.1(K)
VBAT: C10.1 CN1.1 U19.1(Vin)
CC_CSN: U6.12 U10.7(CSn)
CC_GDO0: U6.11 U10.6(GDO0(ATEST))
CC_SCLK: U5.1 U10.1(SCLK)
CC_SI: U6.13 U10.20(SI)
CC_SO: U6.14 U10.2(SO(GDO1))
I2C_SCL: R4.2 U5.7 U14.1(SCL/SPC) U17.2(SCK)
I2C_SDA: R3.2 U5.6 U14.4(SDA/SDI/SDO) U17.4(SDI)
NMEA0183_IN: U6.9 U21.3(RO)
NMEA0183_IN+: CN1.4 U21.4(B)
NMEA0183_IN-: CN1.3 U21.5(A)
PLOTTER_IN: U6.2 U18.2(TXD)
PLOTTER_OUT: U6.3 U18.1(RXD)
RF_N: L1.1 U10.13(RF_N)
RF_P: L2.1 U10.12(RF_P)
UBLOX_RX: U5.2
UBLOX_TX: U5.3
XTAL_Q1: C1.1 U2.1(OSC1) U10.8(XOSC_Q1)
XTAL_Q2: C2.2 U2.3(OSC2) U10.10(XOSC_Q2)
$1N11: C3.2 C4.1 L1.2 L3.1
$1N13: C5.1 L3.2 L4.1
$1N14: C7.1 L4.2 L5.1
$1N16: JP1.1(SIG) L5.2
$1N331: C6.1 L6.1
$1N3529: C3.1 C5.2 L2.2 L6.2
$1N7338: C8.1 U10.5(DCOUPL)
$1N7349: R1.1 U10.17(RBIAS)
$10N471: C15.1 U14.5(C1)
$10N473: R6.2 U14.2(CS_XL) U14.3(CS_MAG)
Net-(R5-2): R5.2 U17.7(INT)

Not connected (* = marked no-connect by the designer): U5 4* 5* 8* 9* 10* 11* 14*; U6 4* 5* 6* 7* 8* 10*; U10 3(GDO2)*; U14 7(INT_MAG/DRDY)* 11(INT_2_XL)* 12(INT_1_XL)*; U18 5(LED)*

## Notes on the sheets
sheet 1
- CC1101
- 26MHz XTal oscillator
- 868/915MHz antenna filter
sheet 2
- Teensy Microcontroller
sheet 3
- External Connector
- AIS NMEA0183/RS422 Transciever
- Bluetooth RS232 Transciever
sheet 4
- LSM303 Magnetic field and acceleration
- BMP-580 Pressure & Temperature
sheet 5
- Power Supply

# Board PCB
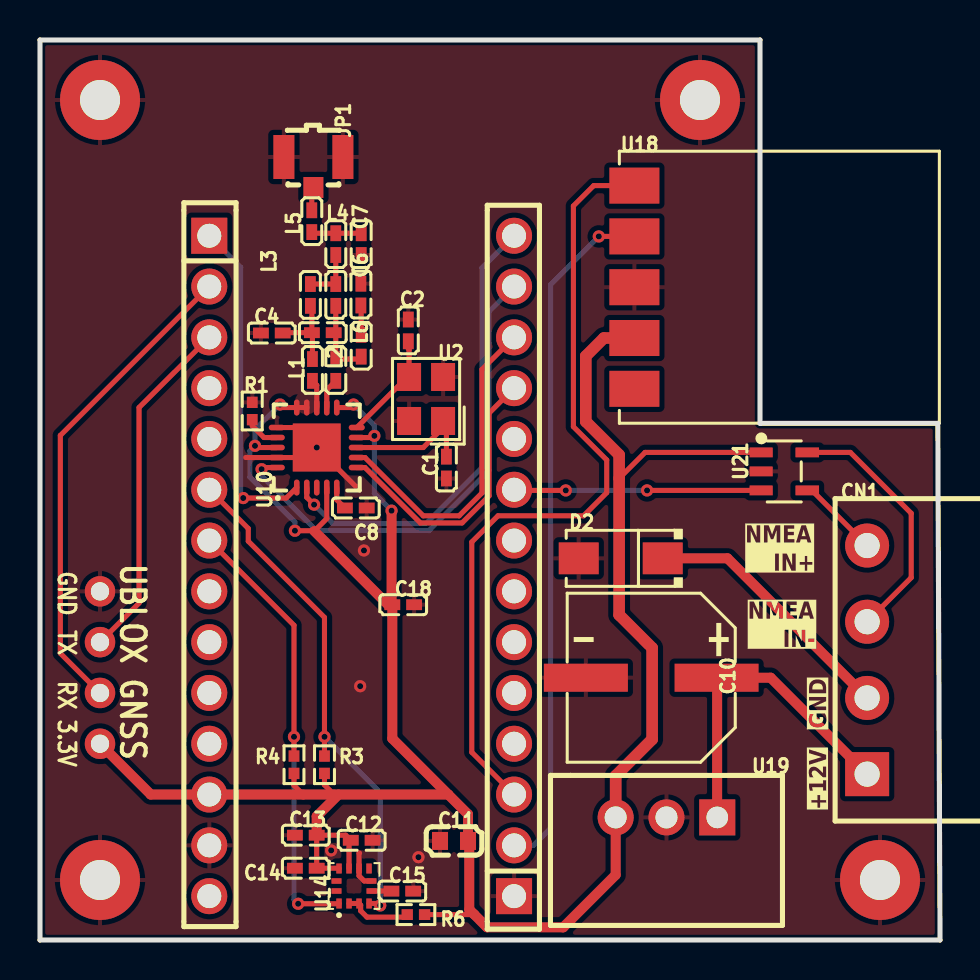
[diagram p5: board, top side]
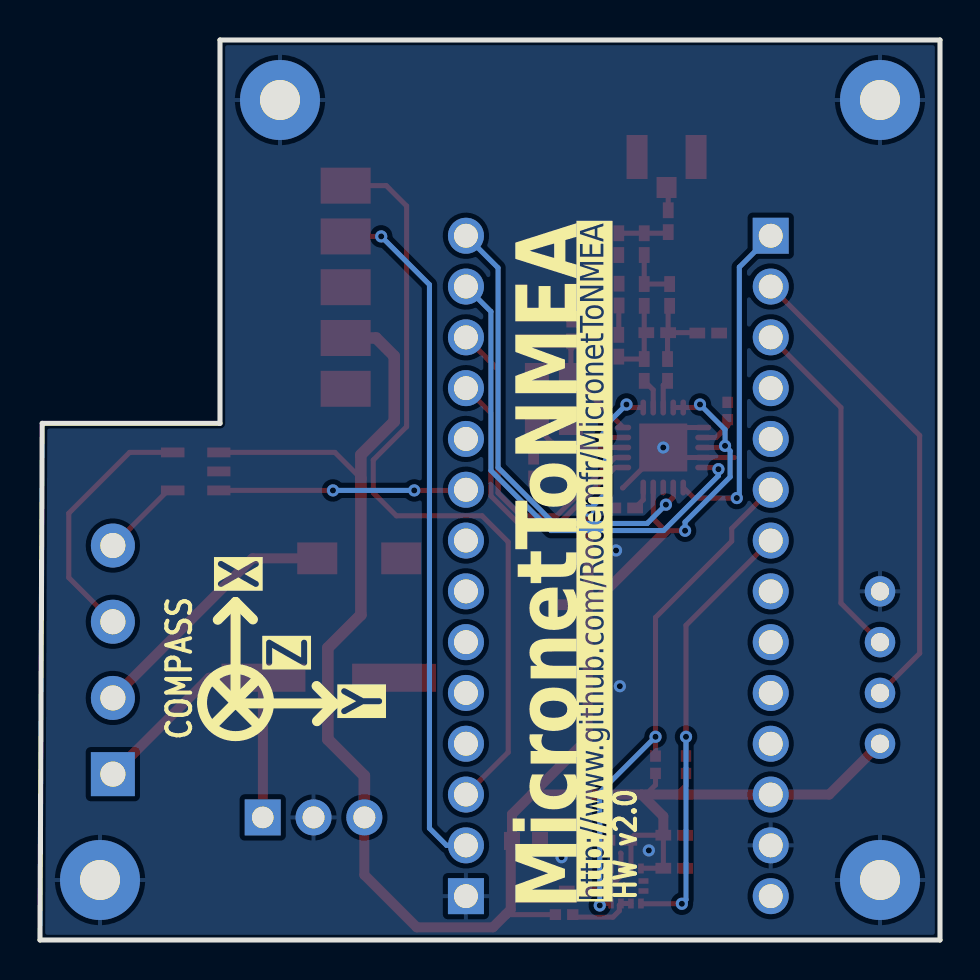
[diagram p6: board, bottom side, seen from below]

Outline 45 x 45 mm; copper layers: Top Layer, Bottom Layer. Coordinates in mm from the lower left corner of the outline.
Outline path: 0,45 36,45 36,25.83 44.89,25.83 45,0 0,0 0,45
Stack: Top Layer 0.035mm / Dielectric1 1.51mm FR4 er 4.5 / Bottom Layer 0.035mm

## Design rules (mm)
template: JLCPCB Capability(Two Layers Board)
spacing copperThickness1oz (default): track to track 0.102, other pairs 0.152 to 0.3
spacing copperThickness2oz: track to track 0.203, other pairs 0.152 to 0.3
track width copperThickness1oz (default): min 0.127, default 0.254, max 2.54
track width copperThickness2oz: min 0.203, default 0.254, max 2.54
differential pair differentialPair (default): width min 0.127, default 0.254, max 2.54; gap min 0.152, default 0.152
via viaSize (default): diameter min 0.5, default 0.61, max 10; hole min 0.3, default 0.305, max 6.3
net +3.3V uses copperThickness2oz

## Placement (name value [footprint] x y rotation side)
C1  27pF  [C0402]  20.32 23.62 270 top
C2  27pF  [C0402]  18.41 30.48 270 top
C3  1pF  [C0402]  14.14 30.37 180 top
C4  1.5pF  [C0402]  11.59 30.35 180 top
C5  1.5pF  [C0402]  14.79 32.25 270 top
C6  100pF  [C0402]  16.04 32.27 90 top
C7  3.3pF  [C0402]  16.06 34.79 270 top
C8  100nF  [C0402]  15.79 21.6 0 top
C10  100uF  [CAP-SMD_BD8.0-L8.3-W8.3-FD]  30.56 13.11 180 top
C11  22uF  [C0603]  20.7 4.95 0 top
C12  100nF  [C0402]  16.08 4.99 0 top
C13  10uF  [C0402]  13.29 5.24 180 top
C14  100nF  [C0402]  13.29 3.59 0 top
C15  220nF  [C0402]  18.12 2.45 0 top
C18  10uF  [C0402]  18.16 16.76 180 top
CN1  WJ15EDGRC-3.81-4P  [CONN-TH_WJ15EDGRC-3.81-4P]  41.36 14.01 90 top
D2  1N4007  [SMA_L4.3-W2.5-LS5.0-RD]  29.04 19.08 180 top
JP1  U.FL-R-SMT-1(80)  [RF-SMD_FRF05002-JSS103M]  13.67 38.39 0 top
L1  12nH  [L0402]  13.62 28.5 90 top
L2  12nH  [L0402]  14.79 28.5 90 top
L3  18nH  [L0402]  13.52 32.25 90 top
L4  12nH  [L0402]  14.79 34.79 90 top
L5  12nH  [L0402]  13.59 35.94 90 top
L6  18nH  [L0402]  16.06 29.71 270 top
NOREF  -  [Pad_e42]  3 14.89 0 top
NOREF#2  -  [Pad_e34]  33 42 0 top
NOREF#3  -  [Pad_e22]  3 17.43 0 top
NOREF#4  -  [Pad_e28]  3 12.35 0 top
NOREF#5  -  [Pad_e23]  3 9.81 0 top
NOREF#6  -  [Pad_e35]  3 3 0 top
NOREF#7  -  [Pad_e14821]  3 42 0 top
NOREF#8  -  [Pad_e4094]  42 3 0 top
R1  56kΩ  [R0402]  10.61 26.45 90 top
R3  4.7kΩ  [R0402]  14.22 8.76 90 top
R4  4.7kΩ  [R0402]  12.7 8.76 90 top
R6  10kΩ  [R0402]  18.8 1.27 180 top
U2  26MHz  [CRYSTAL-SMD_4P-L3.2-W2.5-BL]  19.3 27.05 90 top
U5  KH-2.54FH-1X14P-H8.5  [HDR-TH_14P-P2.54-V-F]  8.46 18.7 270 top
U6  KH-2.54FH-1X14P-H8.5  [HDR-TH_14P-P2.54-V-F]  23.7 18.7 90 top
U10  CC1101RGPR  [QFN-20_L4.0-W4.0-P0.5-TL-EP]  13.84 24.62 90 top
U14  LSM303AGRTR  [LGA-12_L2.0-W2.0-P0.50-BL]  15.7 2.7 0 top
U18  VG6328A  [COMM-SMD_VG6328A]  29.72 32.64 270 top
U19  K7803-500  [PWRM-TH_K7803-500]  31.32 6.13 0 top
U21  MAX3280EAUK+T  [SOT-23-5_L3.0-W1.7-P0.95-LS2.8-BL]  37.21 23.43 270 top

## Footprints (pads in the part's own frame, mm; a bottom-side part is the same pattern mirrored in y, then rotated)
C0402
  rect 0.79x0.54 smd: 1(-0.545,0) 2(0.545,0)
C0603
  rect 0.8x0.9 smd: 1(-0.7,0) 2(0.7,0)
CAP-SMD_BD8.0-L8.3-W8.3-FD
  rect 4.2x1.4 smd: 1(-3.267,0) 2(3.267,0)
COMM-SMD_VG6328A
  rect 1.8x2.5 smd: 1(-5.08,0) 2(-2.54,0) 3(0,0) 4(2.54,0) 5(5.08,0)
CONN-TH_WJ15EDGRC-3.81-4P
  rect 2.2x2.2 hole 1.26: 1(-5.715,0)
  round 2.2 hole 1.26: 2(-1.905,0) 3(1.905,0) 4(5.715,0)
CRYSTAL-SMD_4P-L3.2-W2.5-BL
  rect 1.4x1.2 smd: 1(-1.1,-0.85) 2(1.1,-0.85) 3(1.1,0.85) 4(-1.1,0.85)
HDR-TH_14P-P2.54-V-F
  rect 1.8x1.8 hole 1.2: 1(-16.51,0)
  round 1.8 hole 1.2: 2(-13.97,0) 3(-11.43,0) 4(-8.89,0) 5(-6.35,0) 6(-3.81,0) 7(-1.27,0) 8(1.27,0) 9(3.81,0) 10(6.35,0) 11(8.89,0) 12(11.43,0) 13(13.97,0) 14(16.51,0)
L0402
  rect 0.79x0.54 smd: 1(-0.545,0) 2(0.545,0)
LGA-12_L2.0-W2.0-P0.50-BL
  rect 0.28x0.5 smd: 1(-0.75,-0.875) 2(-0.25,-0.875) 3(0.25,-0.875) 4(0.75,-0.875) 7(0.75,0.875) 8(0.25,0.875) 9(-0.25,0.875) 10(-0.75,0.875)
  rect 0.5x0.28 smd: 5(0.875,-0.25) 6(0.875,0.25) 11(-0.875,0.25) 12(-0.875,-0.25)
Pad_e22
  round 1.524 hole 0.914: 1(0,0)
Pad_e23
  round 1.524 hole 0.914: 2(0,0)
Pad_e28
  round 1.524 hole 0.914: 3(0,0)
Pad_e34
  round 4 hole 2: 1(0,0)
Pad_e35
  round 4 hole 2: 1(0,0)
Pad_e42
  round 1.524 hole 0.914: 4(0,0)
Pad_e4094
  round 4 hole 2: 1(0,0)
Pad_e14821
  round 4 hole 2: 1(0,0)
PWRM-TH_K7803-500
  rect 1.8x1.8 hole 1.082: 1(2.54,0)
  round 1.8 hole 1.1: 2(0,0) 3(-2.54,0)
QFN-20_L4.0-W4.0-P0.5-TL-EP
  oval 0.8x0.28 smd: 1(-2,1) 2(-2,0.5) 3(-2,0) 4(-2,-0.5) 5(-2,-1) 11(2,-1) 12(2,-0.5) 13(2,0) 14(2,0.5) 15(2,1)
  oval 0.28x0.8 smd: 6(-1,-2) 7(-0.5,-2) 8(0,-2) 9(0.5,-2) 10(1,-2) 16(1,2) 17(0.5,2) 18(0,2) 19(-0.5,2) 20(-1,2)
  rect 2.4x2.4 smd: 21(0,0)
R0402
  rect 0.566x0.54 smd: 1(-0.433,0) 2(0.433,0)
RF-SMD_FRF05002-JSS103M
  rect 1x1.05 smd: 1(0,-0.762)
  rect 1.05x2.2 smd: 2(-1.475,0.762) 3(1.475,0.762)
SMA_L4.3-W2.5-LS5.0-RD
  rect 2x1.593 smd: 1(-2.1,0) 2(2.1,0)
SOT-23-5_L3.0-W1.7-P0.95-LS2.8-BL
  rect 0.49x1.157 smd: 1(-0.95,-1.153) 2(0,-1.153) 3(0.95,-1.153)
  rect 0.49x1.175 smd: 4(0.95,1.153) 5(-0.95,1.153)

## Nets
As in the schematic, except:
+3.3V: C11.2 C12.1 C13.1 C14.2 C18.2 NOREF#5.2 R3.1 R4.1 R6.1 U5.12 U10.4 U10.9 U10.11 U10.14 U10.15 U10.18 U14.9 U14.10 U18.4 U19.3 U21.1
GND: C1.2 C2.1 C4.2 C6.2 C7.2 C8.2 C10.2 C11.1 C12.2 C13.2 C14.1 C15.2 C18.1 D2.2 JP1.2 JP1.3 NOREF#2.1 NOREF#3.1 NOREF#6.1 NOREF#7.1 NOREF#8.1 R1.2 U2.2 U2.4 U5.13 U6.1 U10.16 U10.19 U10.21 U14.6 U14.8 U18.3 U19.2 U21.2
UBLOX_RX: NOREF#4.3 U5.2
UBLOX_TX: NOREF.4 U5.3

Pads without a net: U5 4 5 8 9 10 11 14; U6 4 5 6 7 8 10; U10 3; U14 7 11 12; U18 5

## Via types
v1: diameter 0.61, hole 0.305, Top Layer to Bottom Layer, 21 vias

## Routing (per net, layer and track width the routed paths; a pad name or vN(x,y) marks a point on that pad's centre or on a via; arc(x,y) is an arc through that point)
+3.3V: length 127.9
  Top Layer w0.254: 28.96,23.08 30.25,24.38 U21.1 ; v1(10.75,24.71) 10.83,24.62 U10.18 ; U10.11 15.53,26.62 v1(15.68,26.77) ; U10.9 16.63,25.12 v1(16.72,25.21) ; 13.7,20.46 v1(12.75,20.46) ; v1(12,26.77) 12.15,26.62 U10.15 U10.14 ; 13.72,20.45 14.34,21.07 U10.4 ; 13.16,7.27 12.7,7.73 R4.1 ; 21.71,1.28 21.69,1.27 R6.1 ; 14.7,7.27 14.22,7.75 R3.1 ; U14.9 15.45,4.9 C12.1 15.28,5.24 C13.1 C14.2 14.94,3.59 U14.10
  Top Layer w0.5: C18.2 17.58,16.8 v1(17.58,21.47) ; C18.2 17.62,10.07 20.41,7.27 ; C18.2 17.4,16.76 13.72,20.45 ; 20.41,7.27 14.92,7.27 ; 20.41,7.27 21.4,6.28 C11.2 21.46,4.89 21.46,1.52 22.35,0.63 26.16,0.63 28.78,3.26 U19.3 ; 14.92,7.27 U5.12 5.54,7.27 NOREF#5.2 ; 14.92,7.27 13.83,6.18 C13.1
  Top Layer w0.58: 29.72,30.1 28.19,30.1 27.29,29.19 27.29,25.92 28.96,24.26 28.96,16.26 30.61,14.61 30.61,10.03 28.78,8.21 U19.3
  Bottom Layer w0.254: v1(12,26.77) 10.75,25.52 v1(10.75,24.71) 10.5,24.45 10.5,23.15 12.75,20.9 v1(12.75,20.46) ; v1(17.58,21.47) 16.72,22.33 v1(16.72,25.21) 16.72,25.73 v1(15.68,26.77)
GND: length 10.2
  Top Layer w0.254: 15.98,4.35 15.95,4.33 U14.8 15.95,3.21 16.21,2.95 U14.6 ; U10.16 12.84,25.62 v1(13.84,24.62) 15.86,22.61 15.88,22.61 ; 13.34,24.12 U10.19 10.29,24.12
  vias: v1(14.56,4.48) v1(16.01,12.69) v1(16.2,19.48) v1(18.92,4.14)
GNDBAT: length 13.2
  Top Layer w0.5: CN1.2 34.38,19.08 D2.1 ; 41.36,11.59 41.36,11.73
VBAT: length 16.5
  Top Layer w0.5: CN1.1 36.53,13.11 33.86,13.11 33.86,6.14 U19.1
CC_CSN: length 16.4
  Top Layer w0.254: U10.7 16.25,24.12 19.16,21.21 20.96,21.21 22.1,22.35 22.1,28.53 U6.12
CC_GDO0: length 14.2
  Top Layer w0.254: U10.6 16.25,23.62 19.02,20.85 21.1,20.85 22.45,22.2 22.45,26.34 U6.11
CC_SCLK: length 16.7
  Top Layer w0.254: U10.1 12.31,22.1 v1(10.16,22.1)
  Bottom Layer w0.254: U5.1 10.03,33.64 10.03,22.22 v1(10.16,22.1)
CC_SI: length 24.6
  Top Layer w0.254: v1(11.08,23.54) 11.16,23.62 U10.20
  Bottom Layer w0.254: U6.13 22.45,31.42 22.45,23.47 19.45,20.47 13.82,20.47 11.08,23.21 v1(11.08,23.54)
CC_SO: length 23.2
  Top Layer w0.254: v1(13.7,21.77) 13.34,22.13 U10.2
  Bottom Layer w0.254: U6.14 22.1,33.61 22.1,23.62 19.3,20.83 14.64,20.83 v1(13.7,21.77)
I2C_SCL: length 23
  Top Layer w0.254: R4.2 v1(12.7,10.16) 12.7,15.74 U5.7 ; v1(12.91,1.81) 14.94,1.81 U14.1
  Bottom Layer w0.254: v1(12.91,1.81) 12.7,2.02 v1(12.7,10.16)
I2C_SDA: length 25.9
  Top Layer w0.254: U14.4 16.91,1.83 v1(17.01,1.73) ; R3.2 v1(14.22,10.16) 14.22,16.13 10.41,19.94 10.41,20.57 8.48,22.51 U5.6
  Bottom Layer w0.254: v1(17.01,1.73) 17.01,7.37 v1(14.22,10.16)
NMEA0183_IN: length 12.4
  Top Layer w0.254: 35.99,22.45 36.06,22.51 ; v1(30.35,22.48) 35.99,22.48 ; U6.9 23.74,22.48 v1(26.29,22.48)
  Bottom Layer w0.254: v1(30.35,22.48) v1(26.29,22.48)
NMEA0183_IN+: length 4.1
  Top Layer w0.254: U21.4 38.6,22.48 CN1.4
NMEA0183_IN-: length 12.8
  Top Layer w0.254: CN1.3 43.56,18.12 43.56,21.34 40.52,24.38 U21.5
PLOTTER_IN: length 34.5
  Top Layer w0.254: v1(27.94,35.18) U18.2
  Bottom Layer w0.254: U6.2 24.67,4.73 25.53,5.59 25.53,32.77 v1(27.94,35.18)
PLOTTER_OUT: length 39.8
  Top Layer w0.254: U18.1 27.69,37.72 26.67,36.7 26.67,25.67 28.34,24 28.34,22.37 27.18,21.21 22.9,21.21 21.59,19.9 21.59,9.39 U6.3
RF_N: length 1.4
  Top Layer w0.254: L1.1 13.84,27.74 U10.13
RF_P: length 1.5
  Top Layer w0.254: U10.12 14.34,27.51 L2.1
UBLOX_RX: length 24.2
  Top Layer w0.254: NOREF#4.3 1.02,14.34 1.02,25.23 U5.2
UBLOX_TX: length 17.5
  Top Layer w0.254: NOREF.4 4.95,16.85 4.95,26.62 U5.3
XTAL_Q1: length 6.9
  Top Layer w0.254: C1.1 20.32,25.78 U2.1 20.15,25.61 19.16,24.62 U10.8
XTAL_Q2: length 5.3
  Top Layer w0.254: 18.41,29.55 18.45,29.52 18.45,27.77 17.98,27.77 U10.10
$1N11: length 4.2
  Top Layer w0.254: L3.1 13.59,31.63 C3.2 ; C4.1 12.15,30.37 C3.2 ; C3.2 13.62,30.34 L1.2
$1N13: length 2.7
  Top Layer w0.254: L3.2 C5.1 L4.1
$1N14: length 2.5
  Top Layer w0.254: C7.1 L4.2 13.65,35.34 L5.1
$1N16: length 1.2
  Top Layer w0.254: JP1.1 13.59,37.54 L5.2
$1N331: length 1.5
  Top Layer w0.254: L6.1 16.06,31.71 C6.1
$1N3529: length 4.1
  Top Layer w0.254: C5.2 14.79,30.47 C3.1 14.79,30.26 L2.2 15.94,29.05 L6.2
$1N7338: length 1.2
  Top Layer w0.254: C8.1 14.84,22.01 U10.5
$1N7349: length 1.8
  Top Layer w0.254: U10.17 11.2,25.12 10.61,25.71 R1.1
$10N471: length 1
  Top Layer w0.254: 17.61,2.43 17.58,2.45 U14.5
$10N473: length 3.4
  Top Layer w0.254: U14.2 U14.3 16.03,1.74 16.03,1.46 16.35,1.14 18.24,1.14 R6.2

## Copper pours and planes (outline as drawn; the poured copper is in the pictures)
GND on Top Layer: -0.63,45.72 45.47,45.72 45.47,-0.51 -0.63,-0.51
GND on Bottom Layer: -0.63,45.72 45.72,45.72 45.72,-0.89 -0.63,-0.89

## Text on the board
Bottom Silkscreen Layer: HW v2.0 | COMPASS | Y | Z | X | http://www.github.com/Rodemfr/MicronetToNMEA | MicronetToNMEA
Top Silkscreen Layer: GND | TX | RX | 3.3V | UBLOX GNSS | NMEA / IN+ | NMEA / IN- | +12V
